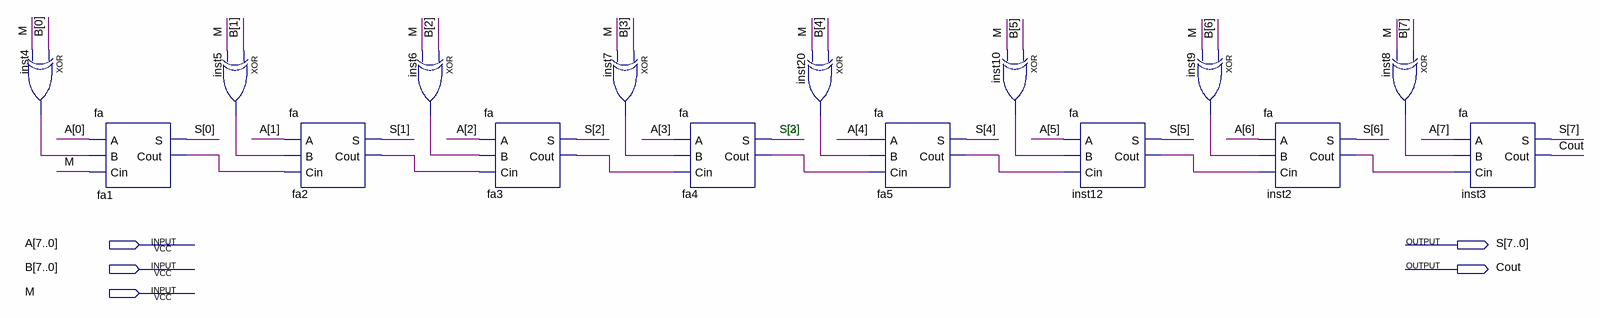
[diagram p0: schematic sheet]
// Quartus schematic sumsub.bdf as structural Verilog: 16 symbols, 5 pins
module sumsub (
  input  [7:0] A,
  input  [7:0] B,
  input  M,
  output [7:0] S,
  output Cout
);

  wire fa1_cout, fa2_cout, fa3_cout, fa4_cout, fa5_cout, inst2_cout, inst4_out, inst5_out, inst6_out,
       inst7_out, inst8_out, inst9_out, inst10_out, inst12_cout, inst20_out;

  xor inst4 (inst4_out, B[0], M);
  fa fa1 (.A(A[0]), .B(inst4_out), .Cin(M), .S(S[0]), .Cout(fa1_cout));
  xor inst5 (inst5_out, B[1], M);
  fa fa2 (.A(A[1]), .B(inst5_out), .Cin(fa1_cout), .S(S[1]), .Cout(fa2_cout));
  xor inst6 (inst6_out, B[2], M);
  fa fa3 (.A(A[2]), .B(inst6_out), .Cin(fa2_cout), .S(S[2]), .Cout(fa3_cout));
  xor inst7 (inst7_out, B[3], M);
  fa fa4 (.A(A[3]), .B(inst7_out), .Cin(fa3_cout), .S(S[3]), .Cout(fa4_cout));
  xor inst20 (inst20_out, B[4], M);
  fa fa5 (.A(A[4]), .B(inst20_out), .Cin(fa4_cout), .S(S[4]), .Cout(fa5_cout));
  xor inst10 (inst10_out, B[5], M);
  fa inst12 (.A(A[5]), .B(inst10_out), .Cin(fa5_cout), .S(S[5]), .Cout(inst12_cout));
  xor inst9 (inst9_out, B[6], M);
  fa inst2 (.A(A[6]), .B(inst9_out), .Cin(inst12_cout), .S(S[6]), .Cout(inst2_cout));
  xor inst8 (inst8_out, B[7], M);
  fa inst3 (.A(A[7]), .B(inst8_out), .Cin(inst2_cout), .S(S[7]), .Cout(Cout));

  // Notes on the sheet:
  //   S[2]
endmodule
